# Altium schematic sheet Sheet_1_2021-05-11.schdoc
size 292 x 210 mm
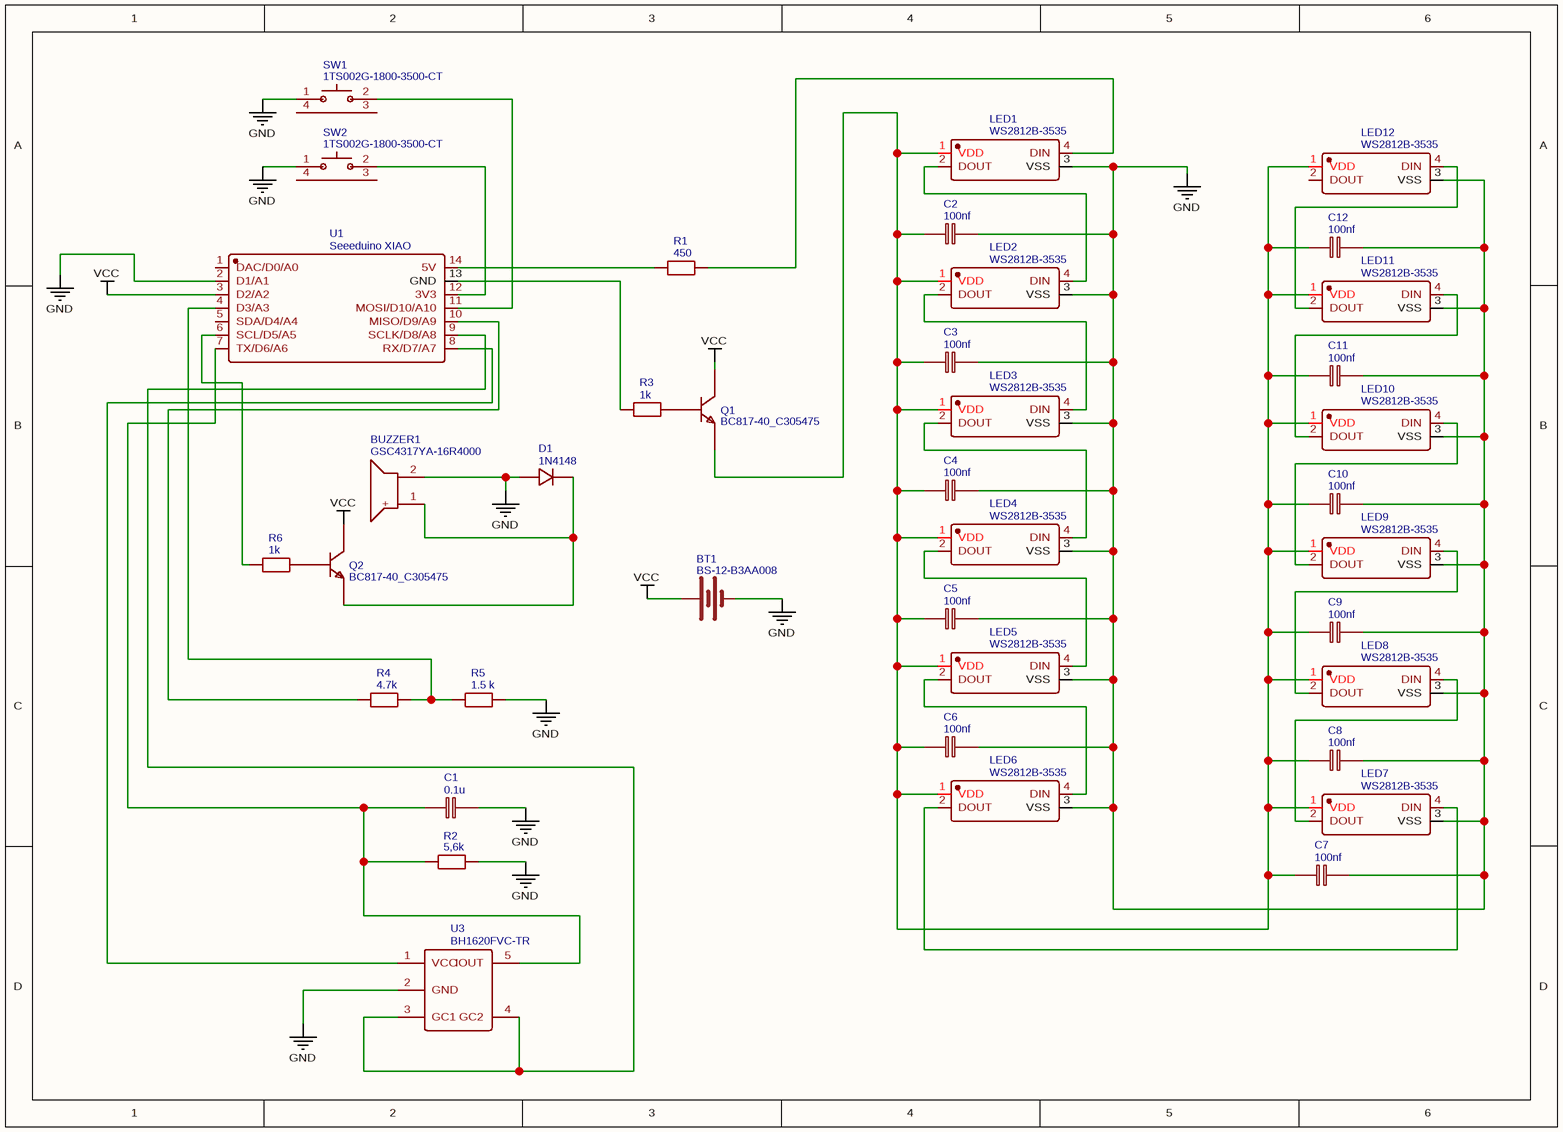
[diagram p0: Sheet_1_2021-05-11.schdoc]

## Parts
BT1  BS-12-B3AA008  [BAT-SMD_BS-12-B3AA011]
BUZZER1  GSC4317YA-16R4000  [BUZ-SMD_2P-L4.0-W4.0-L_GSC4317YA]
C1  0.1u  [C0603]
C2  100nf  [C0603]
C3  100nf  [C0603]
C4  100nf  [C0603]
C5  100nf  [C0603]
C6  100nf  [C0603]
C7  100nf  [C0603]
C8  100nf  [C0603]
C9  100nf  [C0603]
C10  100nf  [C0603]
C11  100nf  [C0603]
C12  100nf  [C0603]
D1  1N4148  [DO-35_BD2.0-L4.0-P8.00-D0.5-FD]
LED1  WS2812B-3535  [LED-SMD_4P-L3.5-W3.5-TL_WS2812B]
LED2  WS2812B-3535  [LED-SMD_4P-L3.5-W3.5-TL_WS2812B]
LED3  WS2812B-3535  [LED-SMD_4P-L3.5-W3.5-TL_WS2812B]
LED4  WS2812B-3535  [LED-SMD_4P-L3.5-W3.5-TL_WS2812B]
LED5  WS2812B-3535  [LED-SMD_4P-L3.5-W3.5-TL_WS2812B]
LED6  WS2812B-3535  [LED-SMD_4P-L3.5-W3.5-TL_WS2812B]
LED7  WS2812B-3535  [LED-SMD_4P-L3.5-W3.5-TL_WS2812B]
LED8  WS2812B-3535  [LED-SMD_4P-L3.5-W3.5-TL_WS2812B]
LED9  WS2812B-3535  [LED-SMD_4P-L3.5-W3.5-TL_WS2812B]
LED10  WS2812B-3535  [LED-SMD_4P-L3.5-W3.5-TL_WS2812B]
LED11  WS2812B-3535  [LED-SMD_4P-L3.5-W3.5-TL_WS2812B]
LED12  WS2812B-3535  [LED-SMD_4P-L3.5-W3.5-TL_WS2812B]
Q1  BC817-40_C305475  [SOT-23-3_L3.0-W1.7-P0.95-LS2.9-BR]
Q2  BC817-40_C305475  [SOT-23-3_L3.0-W1.7-P0.95-LS2.9-BR]
R1  450  [R0603]
R2  5,6k  [R0603]
R3  1k  [R0603]
R4  4.7k  [R0603]
R5  1.5 k  [R0603]
R6  1k  [R0603]
SW1  1TS002G-1800-3500-CT  [KEY-SMD_1TS002G]
SW2  1TS002G-1800-3500-CT  [KEY-SMD_1TS002G]
U1  Seeeduino XIAO  [MODULE XAIO 14P-2.54-21X17.8MM]
U3  BH1620FVC-TR  [WSOF-5_L1.6-W1.2-P0.50-TL]

## Nets
GND: BT1.2(-) BUZZER1.2 C1.2 C2.2 C3.2 C4.2 C5.2 C6.2 C7.2 C8.2 C9.2 C10.2 C11.2 C12.2 D1.1 LED1.3(VSS) LED2.3(VSS) LED3.3(VSS) LED4.3(VSS) LED5.3(VSS) LED6.3(VSS) LED7.3(VSS) LED8.3(VSS) LED9.3(VSS) LED10.3(VSS) LED11.3(VSS) LED12.3(VSS) R2.2 R5.2 SW1.1(A) SW2.1(A) U1.2(D1/A1) U3.2(GND)
VCC: BT1.1(+) Q1.3(C) Q2.3(C) U1.3(D2/A2)
NetBUZZER1_1: BUZZER1.1(+) D1.2 Q2.2(E)
NetC1_1: C1.1 R2.1 U1.7(TX/D6/A6) U3.5(IOUT)
NetC2_1: C2.1 C3.1 C4.1 C5.1 C6.1 C7.1 C8.1 C9.1 C10.1 C11.1 C12.1 LED1.1(VDD) LED2.1(VDD) LED3.1(VDD) LED4.1(VDD) LED5.1(VDD) LED6.1(VDD) LED7.1(VDD) LED8.1(VDD) LED9.1(VDD) LED10.1(VDD) LED11.1(VDD) LED12.1(VDD) Q1.2(E)
NetLED1_2: LED1.2(DOUT) LED2.4(DIN)
NetLED1_4: LED1.4(DIN) R1.2
NetLED2_2: LED2.2(DOUT) LED3.4(DIN)
NetLED3_2: LED3.2(DOUT) LED4.4(DIN)
NetLED4_2: LED4.2(DOUT) LED5.4(DIN)
NetLED5_2: LED5.2(DOUT) LED6.4(DIN)
NetLED6_2: LED6.2(DOUT) LED7.4(DIN)
NetLED7_2: LED7.2(DOUT) LED8.4(DIN)
NetLED8_2: LED8.2(DOUT) LED9.4(DIN)
NetLED9_2: LED9.2(DOUT) LED10.4(DIN)
NetLED10_2: LED10.2(DOUT) LED11.4(DIN)
NetLED11_2: LED11.2(DOUT) LED12.4(DIN)
NetQ1_1: Q1.1(B) R3.2
NetQ2_1: Q2.1(B) R6.2
NetR1_1: R1.1 U1.14(5V)
NetR3_1: R3.1 U1.13(GND)
NetR4_1: R4.1 U1.10(MISO/D9/A9)
NetR4_2: R4.2 R5.1 U1.4(D3/A3)
NetR6_1: R6.1 U1.6(SCL/D5/A5)
NetSW1_2: SW1.2(B) U1.11(MOSI/D10/A10)
NetSW2_2: SW2.2(B) U1.12(3V3)
NetU1_8: U1.8(RX/D7/A7) U3.1(VCC)
NetU1_9: U1.9(SCLK/D8/A8) U3.3(GC1) U3.4(GC2)

Not connected (* = marked no-connect by the designer): LED12 2(DOUT); SW1 3 4; SW2 3 4; U1 1(DAC/D0/A0) 5(SDA/D4/A4)

## Library data of the parts
BT1 = BS-12-B3AA008: BOM_Manufacturer: MYOUNG(美阳); Contributor: LCSC; BOM_Supplier: LCSC; BOM_Supplier Part: C964725; BOM_Manufacturer Part: BS-12-B3AA008; spicePre: B; spiceSymbolName: BS-12-B3AA008
BUZZER1 = GSC4317YA-16R4000: BOM_Manufacturer: INGHAi; Contributor: LCSC; BOM_Supplier: LCSC; BOM_Supplier Part: C255307; BOM_Manufacturer Part: GSC4317YA-16R4000; spicePre: B; spiceSymbolName: GSC4317YA-16R4000
C1 = 0.1u: nameAlias: Value(F); Contributor: LCEDA_Lib; spicePre: C; spiceSymbolName: C_0603_EU
C2 = 100nf: nameAlias: Value(F); Contributor: LCEDA_Lib; Package Display: No; spicePre: C; spiceSymbolName: C_0603_EU
C3-C12 = 100nf: nameAlias: Value(F); Contributor: LCEDA_Lib; spicePre: C; spiceSymbolName: C_0603_EU
D1 = 1N4148: BOM_Manufacturer: SEMTECH; Contributor: LCEDA_Lib; Package Display: No; BOM_Supplier: LCSC; BOM_Manufacturer Part: 1N4148; BOM_Supplier Part: C14516; spicePre: D; spiceSymbolName: 1N4148
LED1-LED12 = WS2812B-3535: BOM_Manufacturer: Worldsemi; Contributor: LCSC; SMT Type: Extend; BOM_Assembly Type: smtWeld; BOM_Paste Type: recommend; BOM_Supplier: LCSC; BOM_Manufacturer Part: WS2812B-3535; BOM_Supplier Part: C114583; BOM_JLCPCB SMD: Yes; spicePre: L; spiceSymbolName: WS2812B-3535
Q1 Q2 = BC817-40_C305475: BOM_Manufacturer: BLUE ROCKET; Contributor: LCSC; SMT Type: Extend; BOM_Assembly Type: smtWeld; BOM_Paste Type: expand; BOM_Supplier: LCSC; BOM_Supplier Part: C305475; BOM_Manufacturer Part: BC817-40; BOM_JLCPCB SMD: Yes; BOM_LCSC Assembly: Yes; spicePre: Q; spiceSymbolName: BC817-40_C305475
R1 = 450: nameAlias: Value(Ω); Contributor: LCEDA_Lib; spicePre: R; spiceSymbolName: R_0603_EU
R2 = 5,6k: nameAlias: Value(Ω); Contributor: LCEDA_Lib; spicePre: R; spiceSymbolName: R_0603_EU
R3 R6 = 1k: nameAlias: Value(Ω); Contributor: LCEDA_Lib; spicePre: R; spiceSymbolName: R_0603_EU
R4 = 4.7k: nameAlias: Value(Ω); Contributor: LCEDA_Lib; spicePre: R; spiceSymbolName: R_0603_EU
R5 = 1.5 k: nameAlias: Value(Ω); Contributor: LCEDA_Lib; spicePre: R; spiceSymbolName: R_0603_EU
SW1 SW2 = 1TS002G-1800-3500-CT: BOM_Manufacturer: HYP; Contributor: LCSC; BOM_Supplier: LCSC; BOM_Supplier Part: C319375; BOM_Manufacturer Part: 1TS002G-1800-3500-CT; spicePre: S; spiceSymbolName: 1TS002G-1800-3500-CT
U1 = Seeeduino XIAO: Contributor: paul_1809; link: http://wiki.seeedstudio.com/Seeeduino-XIAO/; spicePre: U; spiceSymbolName: Seeeduino XIAO
U3 = BH1620FVC-TR: BOM_Manufacturer: ROHM; BOM_Supplier: LCSC; BOM_Manufacturer Part: BH1620FVC-TR; image: //image.lceda.cn/szlcsc/C84991.jpg; BOM_Supplier Part: C84991; spicePre: U; spiceSymbolName: BH1620FVC-TR